# EAGLE schematic EthernetPhy (EAGLE 9.4.0)
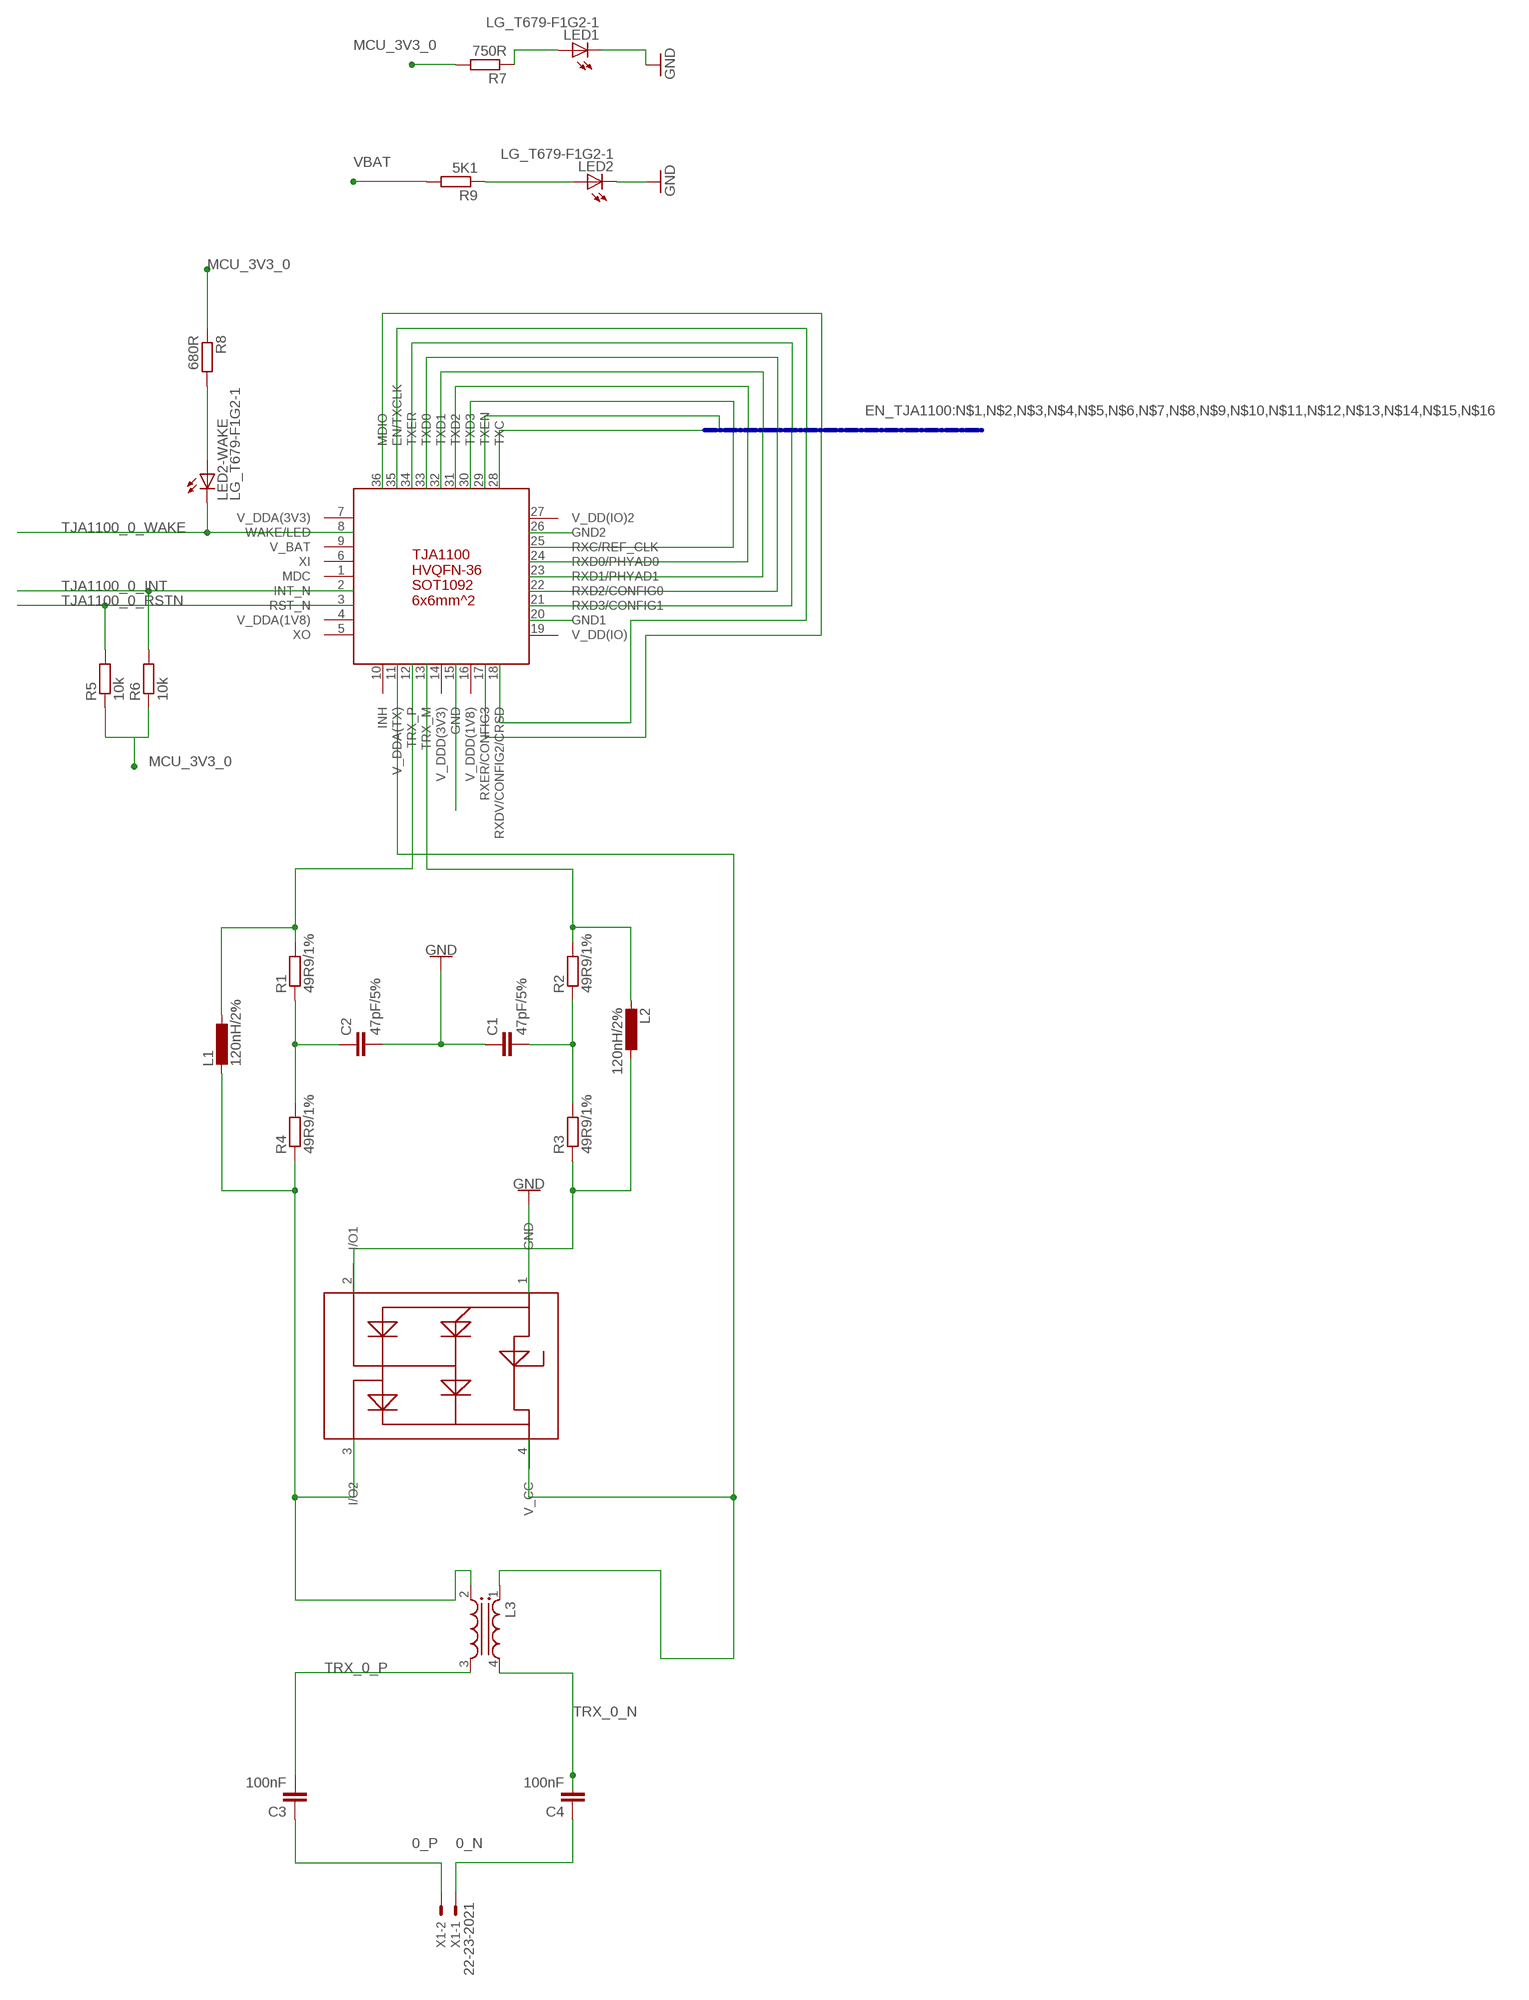
[diagram p0: schematic, sheet 1]

## Parts
C1  47pF/5%  C-EUC0402K  [C0402K]
C2  47pF/5%  C-EUC0402K  [C0402K]
C3  100nF  C-EUC0402K  [C0402K]
C4  100nF  C-EUC0402K  [C0402K]
L1  120nH/2%  L-EUL0201  [L0201]
L2  120nH/2%  L-EUL0201  [L0201]
L3  WE-SL2_744224  [WE-SL2]
LED1  LG_T679-F1G2-1  [PLCC2]
LED2  LG_T679-F1G2-1  [PLCC2]
LED2-WAKE  LG_T679-F1G2-1  [PLCC2]
R1  49R9/1%  R-EU_MELF0207R  [MINI_MELF-0207R]
R2  49R9/1%  R-EU_MELF0207R  [MINI_MELF-0207R]
R3  49R9/1%  R-EU_MELF0207R  [MINI_MELF-0207R]
R4  49R9/1%  R-EU_MELF0207R  [MINI_MELF-0207R]
R5  10k  R-EU_01005  [R01005]
R6  10k  R-EU_01005  [R01005]
R7  750R  R-EU_01005  [R01005]
R8  680R  R-EU_01005  [R01005]
R9  5K1  R-EU_01005  [R01005]
U$1  TJA1100  [QFN50P605X605X100-36]
U$2  PESD2ETH-AX  [SOT192P237X114-4]
X1  22-23-2021  [22-23-2021]

## Nets
0_N: C4.1 X1.1
0_P: C3.1 X1.2
GND: C1.1 C2.2 LED1.C LED2.C U$1.15(GND) U$1.20(GND1) U$1.26(GND2) U$2.1(GND)
MCU_3V3_0: R5.1 R6.1 R7.2 R8.1
N$1: U$1.33(TXD0)
N$2: U$1.32(TXD1)
N$3: U$1.31(TXD2)
N$4: U$1.30(TXD3)
N$5: U$1.34(TXER)
N$6: U$1.35(EN/TXCLK)
N$7: U$1.29(TXEN)
N$8: U$1.28(TXC)
N$9: U$1.36(MDIO)
N$10: U$1.24(RXD0/PHYAD0)
N$11: U$1.23(RXD1/PHYAD1)
N$12: U$1.22(RXD2/CONFIG0)
N$13: U$1.21(RXD3/CONFIG1)
N$14: U$1.25(RXC/REF_CLK)
N$15: U$1.18(RXDV/CONFIG2/CRSD)
N$16: U$1.17(RXER/CONFIG3)
N$17: L1.1 R1.2 U$1.12(TRX_P)
N$18: L2.2 R2.2 U$1.13(TRX_M)
N$19: C2.1 R1.1 R4.2
N$20: C1.2 R2.1 R3.2
N$21: L3.1 U$1.11(V_DDA(TX)) U$2.4(V_CC)
N$22: L1.2 L3.2 R4.1 U$2.3(I/O2)
N$23: L2.1 R3.1 U$2.2(I/O1)
N$24: LED1.A R7.1
N$25: LED2-WAKE.A R8.2
N$26: LED2.A R9.1
TJA1100_0_INT: R6.2 U$1.2(INT_N)
TJA1100_0_RSTN: R5.2 U$1.3(RST_N)
TJA1100_0_WAKE: LED2-WAKE.C U$1.8(WAKE/LED)
TRX_0_N: C4.2 L3.4
TRX_0_P: C3.2 L3.3
VBAT: R9.2
Unconnected: U$1.1(MDC) U$1.4(V_DDA(1V8)) U$1.5(XO) U$1.6(XI) U$1.7(V_DDA(3V3)) U$1.9(V_BAT) U$1.10(INH) U$1.14(V_DDD(3V3)) U$1.16(V_DDD(1V8)) U$1.19(V_DD(IO)) U$1.27(V_DD(IO)2)

## Buses
EN_TJA1100:N$1,N$2,N$3,N$4,N$5,N$6,N$7,N$8,N$9,N$10,N$11,N$12,N$13,N$14,N$15,N$16

## Library data of the parts
C1-C4 = resistor:C-EU: CAPACITOR, European symbol
L1 L2 = rcl:L-EU: INDUCTOR, European symbol; SPICEPREFIX: L
L3 = Wurth_Elektronik_Passive_rev19b:WE-SL2: SMD Common-Mode Line Filter WE-SL2 For distortion-free removal of noise from transmitted electrical signals - Double current-compensated choke - Offering a wide band width with the core materials NiZn/MnZn -- Current compensated choke for data and signal lines -- Power supply systems -- Filter for measurement signals -- CAN <http://katalog.we-online.de/media/images/v2/Family_WE-SL2.jpg> Details see: http://katalog.we-online.de/en/pbs/WE-SL2? Updated by Dan Xu 2014-07-11 2014 (C) Würth Elektronik; WE-NUMBER: 744224/250uH
LED1 LED2 LED2-WAKE = led:*_T679-?-1: LC TOPLED® Low Current LED Source: http://catalog.osram-os.com .. LG_LS_LY_T679_OBS.pdf; COLOR: green
R1-R9 = rcl:R-EU_: RESISTOR, European symbol; SPICEPREFIX: R
U$1 = TJA1100:TJA1100: Single Twisted Pair Ethernet PHY Chip with both RMII and MII interfaces As 100BASE-T1 provides a full-duplex bi-directional communication, the standard MII signals COL and CRS are not needed. Datasheet can be found here <https://www.nxp.com/docs/en/data-sheet/TJA1100.pdf>.
U$2 = PESD2ETH-AX:PESD2ETH-AX
X1 = con-molex:22-23-2021: .100" (2.54mm) Center Header - 2 Pin; MF: MOLEX; MPN: 22-23-2021; OC_FARNELL: 1462926; OC_NEWARK: 25C3832